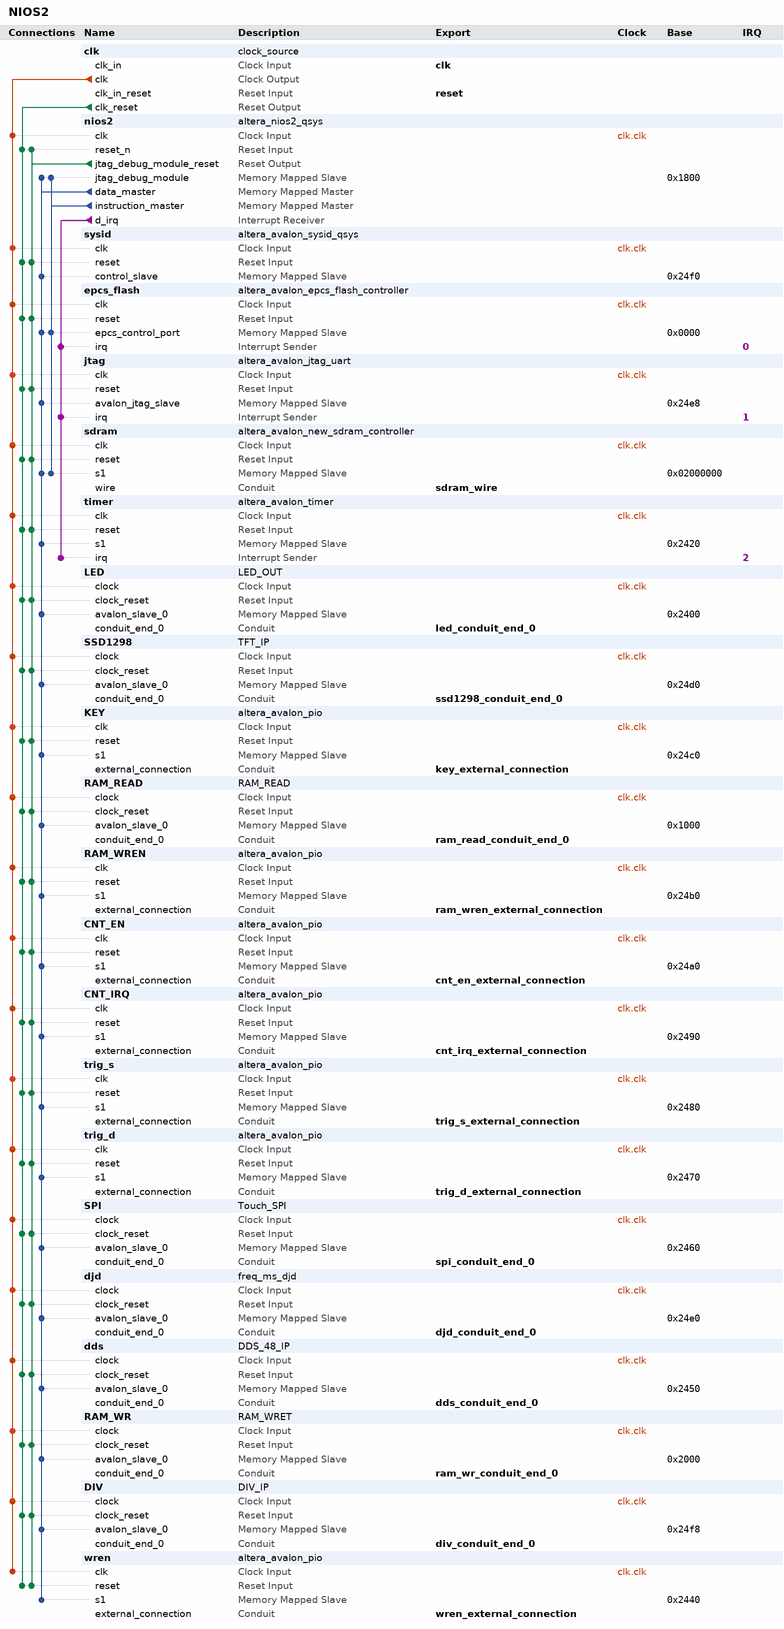
[diagram p0: system contents]
# Platform Designer (Qsys) system NIOS2, Cyclone II EP2C8Q208C8
# Parameters at their usual value, and those the tool derives, are not listed.
package require -exact qsys 13.0.1
create_system NIOS2
set_project_property DEVICE_FAMILY {Cyclone II}
set_project_property DEVICE EP2C8Q208C8

add_instance clk clock_source 13.0
set_instance_parameter_value clk clockFrequency 100000000

add_instance nios2 altera_nios2_qsys 13.0
set_instance_parameter_value nios2 muldiv_divider true
set_instance_parameter_value nios2 resetSlave epcs_flash.epcs_control_port
set_instance_parameter_value nios2 mmu_TLBMissExcSlave None
set_instance_parameter_value nios2 exceptionSlave sdram.s1
set_instance_parameter_value nios2 breakSlave nios2.jtag_debug_module
set_instance_parameter_value nios2 impl Fast
set_instance_parameter_value nios2 icache_size 4096

add_instance sysid altera_avalon_sysid_qsys 13.0
set_instance_parameter_value sysid id 0

add_instance epcs_flash altera_avalon_epcs_flash_controller 13.0.1

add_instance jtag altera_avalon_jtag_uart 13.0.1
set_instance_parameter_value jtag simInteractiveOptions NO_INTERACTIVE_WINDOWS

add_instance sdram altera_avalon_new_sdram_controller 13.0.1
set_instance_parameter_value sdram TAC 5.5
set_instance_parameter_value sdram TRCD 20.0
set_instance_parameter_value sdram TRP 20.0
set_instance_parameter_value sdram casLatency 3
set_instance_parameter_value sdram columnWidth 9
set_instance_parameter_value sdram dataWidth 16
set_instance_parameter_value sdram generateSimulationModel false
set_instance_parameter_value sdram model single_Micron_MT48LC4M32B2_7_chip
set_instance_parameter_value sdram numberOfBanks 4
set_instance_parameter_value sdram numberOfChipSelects 1
set_instance_parameter_value sdram powerUpDelay 100.0
set_instance_parameter_value sdram refreshPeriod 15.625
set_instance_parameter_value sdram rowWidth 12

add_instance timer altera_avalon_timer 13.0.1
set_instance_parameter_value timer period 1
set_instance_parameter_value timer periodUnits MSEC

add_instance LED LED_OUT 1.0

add_instance SSD1298 TFT_IP 1.0

add_instance KEY altera_avalon_pio 13.0.1
set_instance_parameter_value KEY direction Bidir
set_instance_parameter_value KEY resetValue 255
set_instance_parameter_value KEY width 8

add_instance RAM_READ RAM_READ 1.0

add_instance RAM_WREN altera_avalon_pio 13.0.1
set_instance_parameter_value RAM_WREN direction Output
set_instance_parameter_value RAM_WREN resetValue 1
set_instance_parameter_value RAM_WREN width 1

add_instance CNT_EN altera_avalon_pio 13.0.1
set_instance_parameter_value CNT_EN direction Output
set_instance_parameter_value CNT_EN resetValue 1
set_instance_parameter_value CNT_EN width 1

add_instance CNT_IRQ altera_avalon_pio 13.0.1
set_instance_parameter_value CNT_IRQ direction Input
set_instance_parameter_value CNT_IRQ resetValue 1
set_instance_parameter_value CNT_IRQ width 1

add_instance trig_s altera_avalon_pio 13.0.1
set_instance_parameter_value trig_s direction Output
set_instance_parameter_value trig_s resetValue 1
set_instance_parameter_value trig_s width 1

add_instance trig_d altera_avalon_pio 13.0.1
set_instance_parameter_value trig_d direction Output
set_instance_parameter_value trig_d resetValue 127
set_instance_parameter_value trig_d width 8

add_instance SPI Touch_SPI 1.0

add_instance djd freq_ms_djd 1.0

add_instance dds DDS_48_IP 1.0
set_instance_parameter_value dds ROMAD_WIDTH 8

add_instance RAM_WR RAM_WRET 1.0
set_instance_parameter_value RAM_WR RAM_WIDTH 8

add_instance DIV DIV_IP 1.0

add_instance wren altera_avalon_pio 13.0.1
set_instance_parameter_value wren direction Output
set_instance_parameter_value wren width 1

# connections
add_connection clk.clk CNT_EN.clk clock
add_connection clk.clk CNT_IRQ.clk clock
add_connection clk.clk dds.clock clock
add_connection clk.clk DIV.clock clock
add_connection clk.clk djd.clock clock
add_connection clk.clk epcs_flash.clk clock
add_connection clk.clk jtag.clk clock
add_connection clk.clk KEY.clk clock
add_connection clk.clk LED.clock clock
add_connection clk.clk nios2.clk clock
add_connection clk.clk RAM_READ.clock clock
add_connection clk.clk RAM_WR.clock clock
add_connection clk.clk RAM_WREN.clk clock
add_connection clk.clk sdram.clk clock
add_connection clk.clk SPI.clock clock
add_connection clk.clk SSD1298.clock clock
add_connection clk.clk sysid.clk clock
add_connection clk.clk timer.clk clock
add_connection clk.clk trig_d.clk clock
add_connection clk.clk trig_s.clk clock
add_connection clk.clk wren.clk clock
add_connection clk.clk_reset CNT_EN.reset reset
add_connection clk.clk_reset CNT_IRQ.reset reset
add_connection clk.clk_reset dds.clock_reset reset
add_connection clk.clk_reset DIV.clock_reset reset
add_connection clk.clk_reset djd.clock_reset reset
add_connection clk.clk_reset epcs_flash.reset reset
add_connection clk.clk_reset jtag.reset reset
add_connection clk.clk_reset KEY.reset reset
add_connection clk.clk_reset LED.clock_reset reset
add_connection clk.clk_reset nios2.reset_n reset
add_connection clk.clk_reset RAM_READ.clock_reset reset
add_connection clk.clk_reset RAM_WR.clock_reset reset
add_connection clk.clk_reset RAM_WREN.reset reset
add_connection clk.clk_reset sdram.reset reset
add_connection clk.clk_reset SPI.clock_reset reset
add_connection clk.clk_reset SSD1298.clock_reset reset
add_connection clk.clk_reset sysid.reset reset
add_connection clk.clk_reset timer.reset reset
add_connection clk.clk_reset trig_d.reset reset
add_connection clk.clk_reset trig_s.reset reset
add_connection clk.clk_reset wren.reset reset
add_connection nios2.jtag_debug_module_reset CNT_EN.reset reset
add_connection nios2.jtag_debug_module_reset CNT_IRQ.reset reset
add_connection nios2.jtag_debug_module_reset dds.clock_reset reset
add_connection nios2.jtag_debug_module_reset DIV.clock_reset reset
add_connection nios2.jtag_debug_module_reset djd.clock_reset reset
add_connection nios2.jtag_debug_module_reset epcs_flash.reset reset
add_connection nios2.jtag_debug_module_reset jtag.reset reset
add_connection nios2.jtag_debug_module_reset KEY.reset reset
add_connection nios2.jtag_debug_module_reset LED.clock_reset reset
add_connection nios2.jtag_debug_module_reset nios2.reset_n reset
add_connection nios2.jtag_debug_module_reset RAM_READ.clock_reset reset
add_connection nios2.jtag_debug_module_reset RAM_WR.clock_reset reset
add_connection nios2.jtag_debug_module_reset RAM_WREN.reset reset
add_connection nios2.jtag_debug_module_reset sdram.reset reset
add_connection nios2.jtag_debug_module_reset SPI.clock_reset reset
add_connection nios2.jtag_debug_module_reset SSD1298.clock_reset reset
add_connection nios2.jtag_debug_module_reset sysid.reset reset
add_connection nios2.jtag_debug_module_reset timer.reset reset
add_connection nios2.jtag_debug_module_reset trig_d.reset reset
add_connection nios2.jtag_debug_module_reset trig_s.reset reset
add_connection nios2.jtag_debug_module_reset wren.reset reset
add_connection nios2.data_master CNT_EN.s1 avalon
set_connection_parameter_value nios2.data_master/CNT_EN.s1 baseAddress 0x24a0
add_connection nios2.data_master CNT_IRQ.s1 avalon
set_connection_parameter_value nios2.data_master/CNT_IRQ.s1 baseAddress 0x2490
add_connection nios2.data_master dds.avalon_slave_0 avalon
set_connection_parameter_value nios2.data_master/dds.avalon_slave_0 baseAddress 0x2450
add_connection nios2.data_master DIV.avalon_slave_0 avalon
set_connection_parameter_value nios2.data_master/DIV.avalon_slave_0 baseAddress 0x24f8
add_connection nios2.data_master djd.avalon_slave_0 avalon
set_connection_parameter_value nios2.data_master/djd.avalon_slave_0 baseAddress 0x24e0
add_connection nios2.data_master epcs_flash.epcs_control_port avalon
set_connection_parameter_value nios2.data_master/epcs_flash.epcs_control_port baseAddress 0x0000
add_connection nios2.data_master jtag.avalon_jtag_slave avalon
set_connection_parameter_value nios2.data_master/jtag.avalon_jtag_slave baseAddress 0x24e8
add_connection nios2.data_master KEY.s1 avalon
set_connection_parameter_value nios2.data_master/KEY.s1 baseAddress 0x24c0
add_connection nios2.data_master LED.avalon_slave_0 avalon
set_connection_parameter_value nios2.data_master/LED.avalon_slave_0 baseAddress 0x2400
add_connection nios2.data_master nios2.jtag_debug_module avalon
set_connection_parameter_value nios2.data_master/nios2.jtag_debug_module baseAddress 0x1800
add_connection nios2.data_master RAM_READ.avalon_slave_0 avalon
set_connection_parameter_value nios2.data_master/RAM_READ.avalon_slave_0 baseAddress 0x1000
add_connection nios2.data_master RAM_WR.avalon_slave_0 avalon
set_connection_parameter_value nios2.data_master/RAM_WR.avalon_slave_0 baseAddress 0x2000
add_connection nios2.data_master RAM_WREN.s1 avalon
set_connection_parameter_value nios2.data_master/RAM_WREN.s1 baseAddress 0x24b0
add_connection nios2.data_master sdram.s1 avalon
set_connection_parameter_value nios2.data_master/sdram.s1 baseAddress 0x02000000
add_connection nios2.data_master SPI.avalon_slave_0 avalon
set_connection_parameter_value nios2.data_master/SPI.avalon_slave_0 baseAddress 0x2460
add_connection nios2.data_master SSD1298.avalon_slave_0 avalon
set_connection_parameter_value nios2.data_master/SSD1298.avalon_slave_0 baseAddress 0x24d0
add_connection nios2.data_master sysid.control_slave avalon
set_connection_parameter_value nios2.data_master/sysid.control_slave baseAddress 0x24f0
add_connection nios2.data_master timer.s1 avalon
set_connection_parameter_value nios2.data_master/timer.s1 baseAddress 0x2420
add_connection nios2.data_master trig_d.s1 avalon
set_connection_parameter_value nios2.data_master/trig_d.s1 baseAddress 0x2470
add_connection nios2.data_master trig_s.s1 avalon
set_connection_parameter_value nios2.data_master/trig_s.s1 baseAddress 0x2480
add_connection nios2.data_master wren.s1 avalon
set_connection_parameter_value nios2.data_master/wren.s1 baseAddress 0x2440
add_connection nios2.instruction_master epcs_flash.epcs_control_port avalon
set_connection_parameter_value nios2.instruction_master/epcs_flash.epcs_control_port baseAddress 0x0000
add_connection nios2.instruction_master nios2.jtag_debug_module avalon
set_connection_parameter_value nios2.instruction_master/nios2.jtag_debug_module baseAddress 0x1800
add_connection nios2.instruction_master sdram.s1 avalon
set_connection_parameter_value nios2.instruction_master/sdram.s1 baseAddress 0x02000000
add_connection nios2.d_irq epcs_flash.irq interrupt
set_connection_parameter_value nios2.d_irq/epcs_flash.irq irqNumber 0
add_connection nios2.d_irq jtag.irq interrupt
set_connection_parameter_value nios2.d_irq/jtag.irq irqNumber 1
add_connection nios2.d_irq timer.irq interrupt
set_connection_parameter_value nios2.d_irq/timer.irq irqNumber 2

# exported interfaces
add_interface clk clock sink
set_interface_property clk EXPORT_OF clk.clk_in
add_interface reset reset sink
set_interface_property reset EXPORT_OF clk.clk_in_reset
add_interface sdram_wire conduit end
set_interface_property sdram_wire EXPORT_OF sdram.wire
add_interface led_conduit_end_0 conduit end
set_interface_property led_conduit_end_0 EXPORT_OF LED.conduit_end_0
add_interface ssd1298_conduit_end_0 conduit end
set_interface_property ssd1298_conduit_end_0 EXPORT_OF SSD1298.conduit_end_0
add_interface key_external_connection conduit end
set_interface_property key_external_connection EXPORT_OF KEY.external_connection
add_interface ram_read_conduit_end_0 conduit end
set_interface_property ram_read_conduit_end_0 EXPORT_OF RAM_READ.conduit_end_0
add_interface ram_wren_external_connection conduit end
set_interface_property ram_wren_external_connection EXPORT_OF RAM_WREN.external_connection
add_interface cnt_en_external_connection conduit end
set_interface_property cnt_en_external_connection EXPORT_OF CNT_EN.external_connection
add_interface cnt_irq_external_connection conduit end
set_interface_property cnt_irq_external_connection EXPORT_OF CNT_IRQ.external_connection
add_interface trig_s_external_connection conduit end
set_interface_property trig_s_external_connection EXPORT_OF trig_s.external_connection
add_interface trig_d_external_connection conduit end
set_interface_property trig_d_external_connection EXPORT_OF trig_d.external_connection
add_interface spi_conduit_end_0 conduit end
set_interface_property spi_conduit_end_0 EXPORT_OF SPI.conduit_end_0
add_interface dds_conduit_end_0 conduit end
set_interface_property dds_conduit_end_0 EXPORT_OF dds.conduit_end_0
add_interface djd_conduit_end_0 conduit end
set_interface_property djd_conduit_end_0 EXPORT_OF djd.conduit_end_0
add_interface div_conduit_end_0 conduit end
set_interface_property div_conduit_end_0 EXPORT_OF DIV.conduit_end_0
add_interface wren_external_connection conduit end
set_interface_property wren_external_connection EXPORT_OF wren.external_connection
add_interface ram_wr_conduit_end_0 conduit end
set_interface_property ram_wr_conduit_end_0 EXPORT_OF RAM_WR.conduit_end_0

set_interconnect_requirement {$system} qsys_mm.clockCrossingAdapter HANDSHAKE
set_interconnect_requirement {$system} qsys_mm.maxAdditionalLatency 1

save_system NIOS2.qsys
